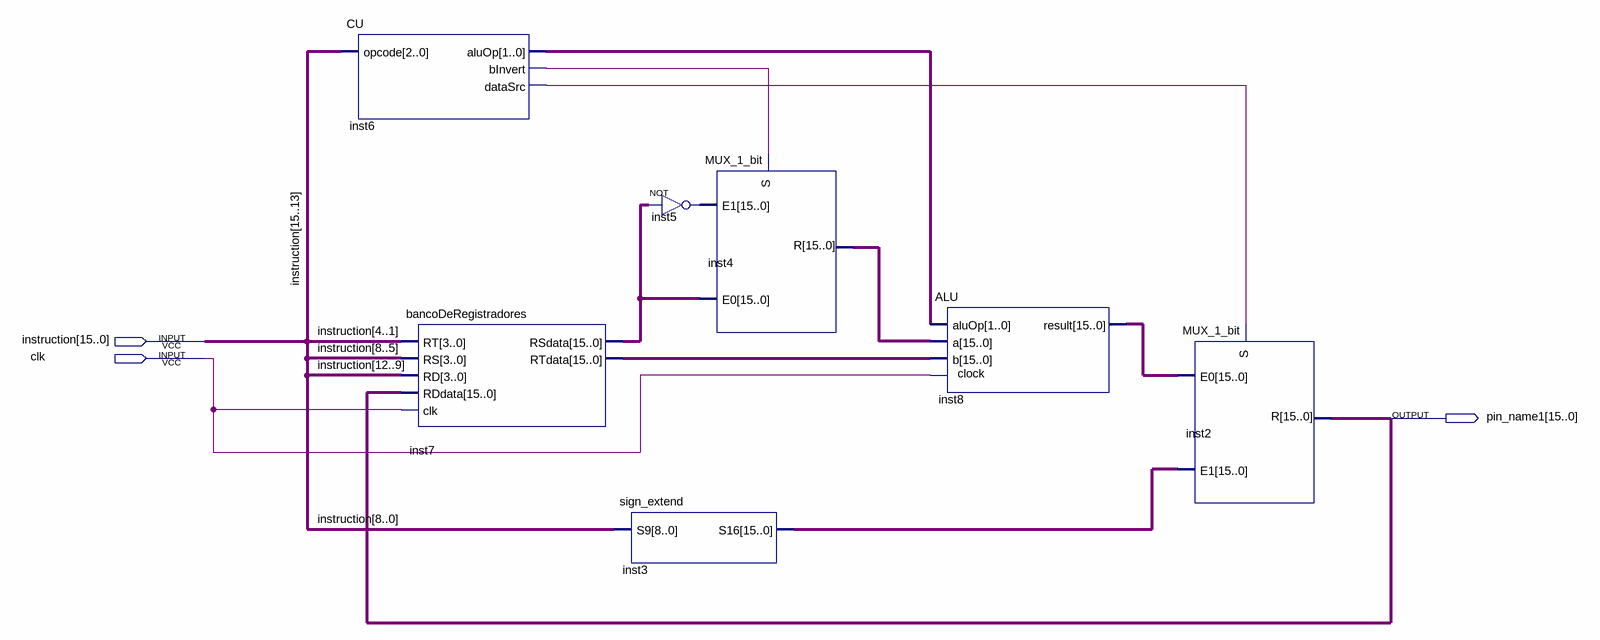
[diagram p0: schematic sheet]
// Quartus schematic IncompleteDatapath.bdf as structural Verilog: 7 symbols, 3 pins
module IncompleteDatapath (
  input  [15:0] instruction,
  input  clk,
  output [15:0] pin_name1
);

  wire inst6_binvert, inst6_datasrc;
  wire [1:0] inst6_aluop;
  wire [15:0] inst3_s16, inst4_r, inst5_out, inst7_rsdata, inst7_rtdata, inst8_result;

  CU inst6 (.opcode(instruction[15:13]), .aluOp(inst6_aluop), .bInvert(inst6_binvert), .dataSrc(inst6_datasrc));
  bancoDeRegistradores inst7 (
    .clk(clk), .RD(instruction[12:9]), .RDdata(pin_name1), .RS(instruction[8:5]), .RT(instruction[4:1]),
    .RSdata(inst7_rsdata), .RTdata(inst7_rtdata));
  sign_extend inst3 (.S9(instruction[8:0]), .S16(inst3_s16));
  assign inst5_out = ~inst7_rsdata;  // NOT inst5, 16 bits wide
  MUX_1_bit inst4 (.S(inst6_binvert), .E0(inst7_rsdata), .E1(inst5_out), .R(inst4_r));
  ALU inst8 (.clock(clk), .a(inst4_r), .aluOp(inst6_aluop), .b(inst7_rtdata), .result(inst8_result));
  MUX_1_bit inst2 (.S(inst6_datasrc), .E0(inst8_result), .E1(inst3_s16), .R(pin_name1));
endmodule
